# Altium project TL750M Application.PrjPcb
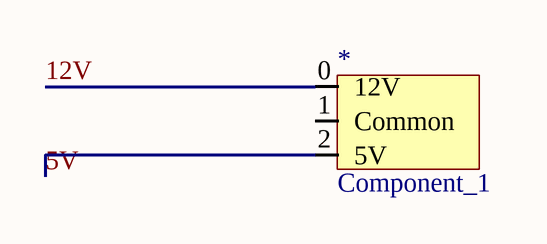
[diagram p0: TL750M Application.SchDoc]
1 sheet, 1 parts. Net scope: global (net labels, ports and power ports of the same name join across sheets).

## Sheet TL750M Application.SchDoc
size A

### Parts
*  Component_1  [PCBComponent_1]

### Nets
5V: *.2(5V)
12V: *.0(12V)

Not connected (* = marked no-connect by the designer): * 1(Common)